# Altium schematic sheet SD-CARD.SchDoc: SD-CARD
size A3; Engineer: M.GUENI; Revision: R0; SheetNumber: 06; SheetTotal: 10
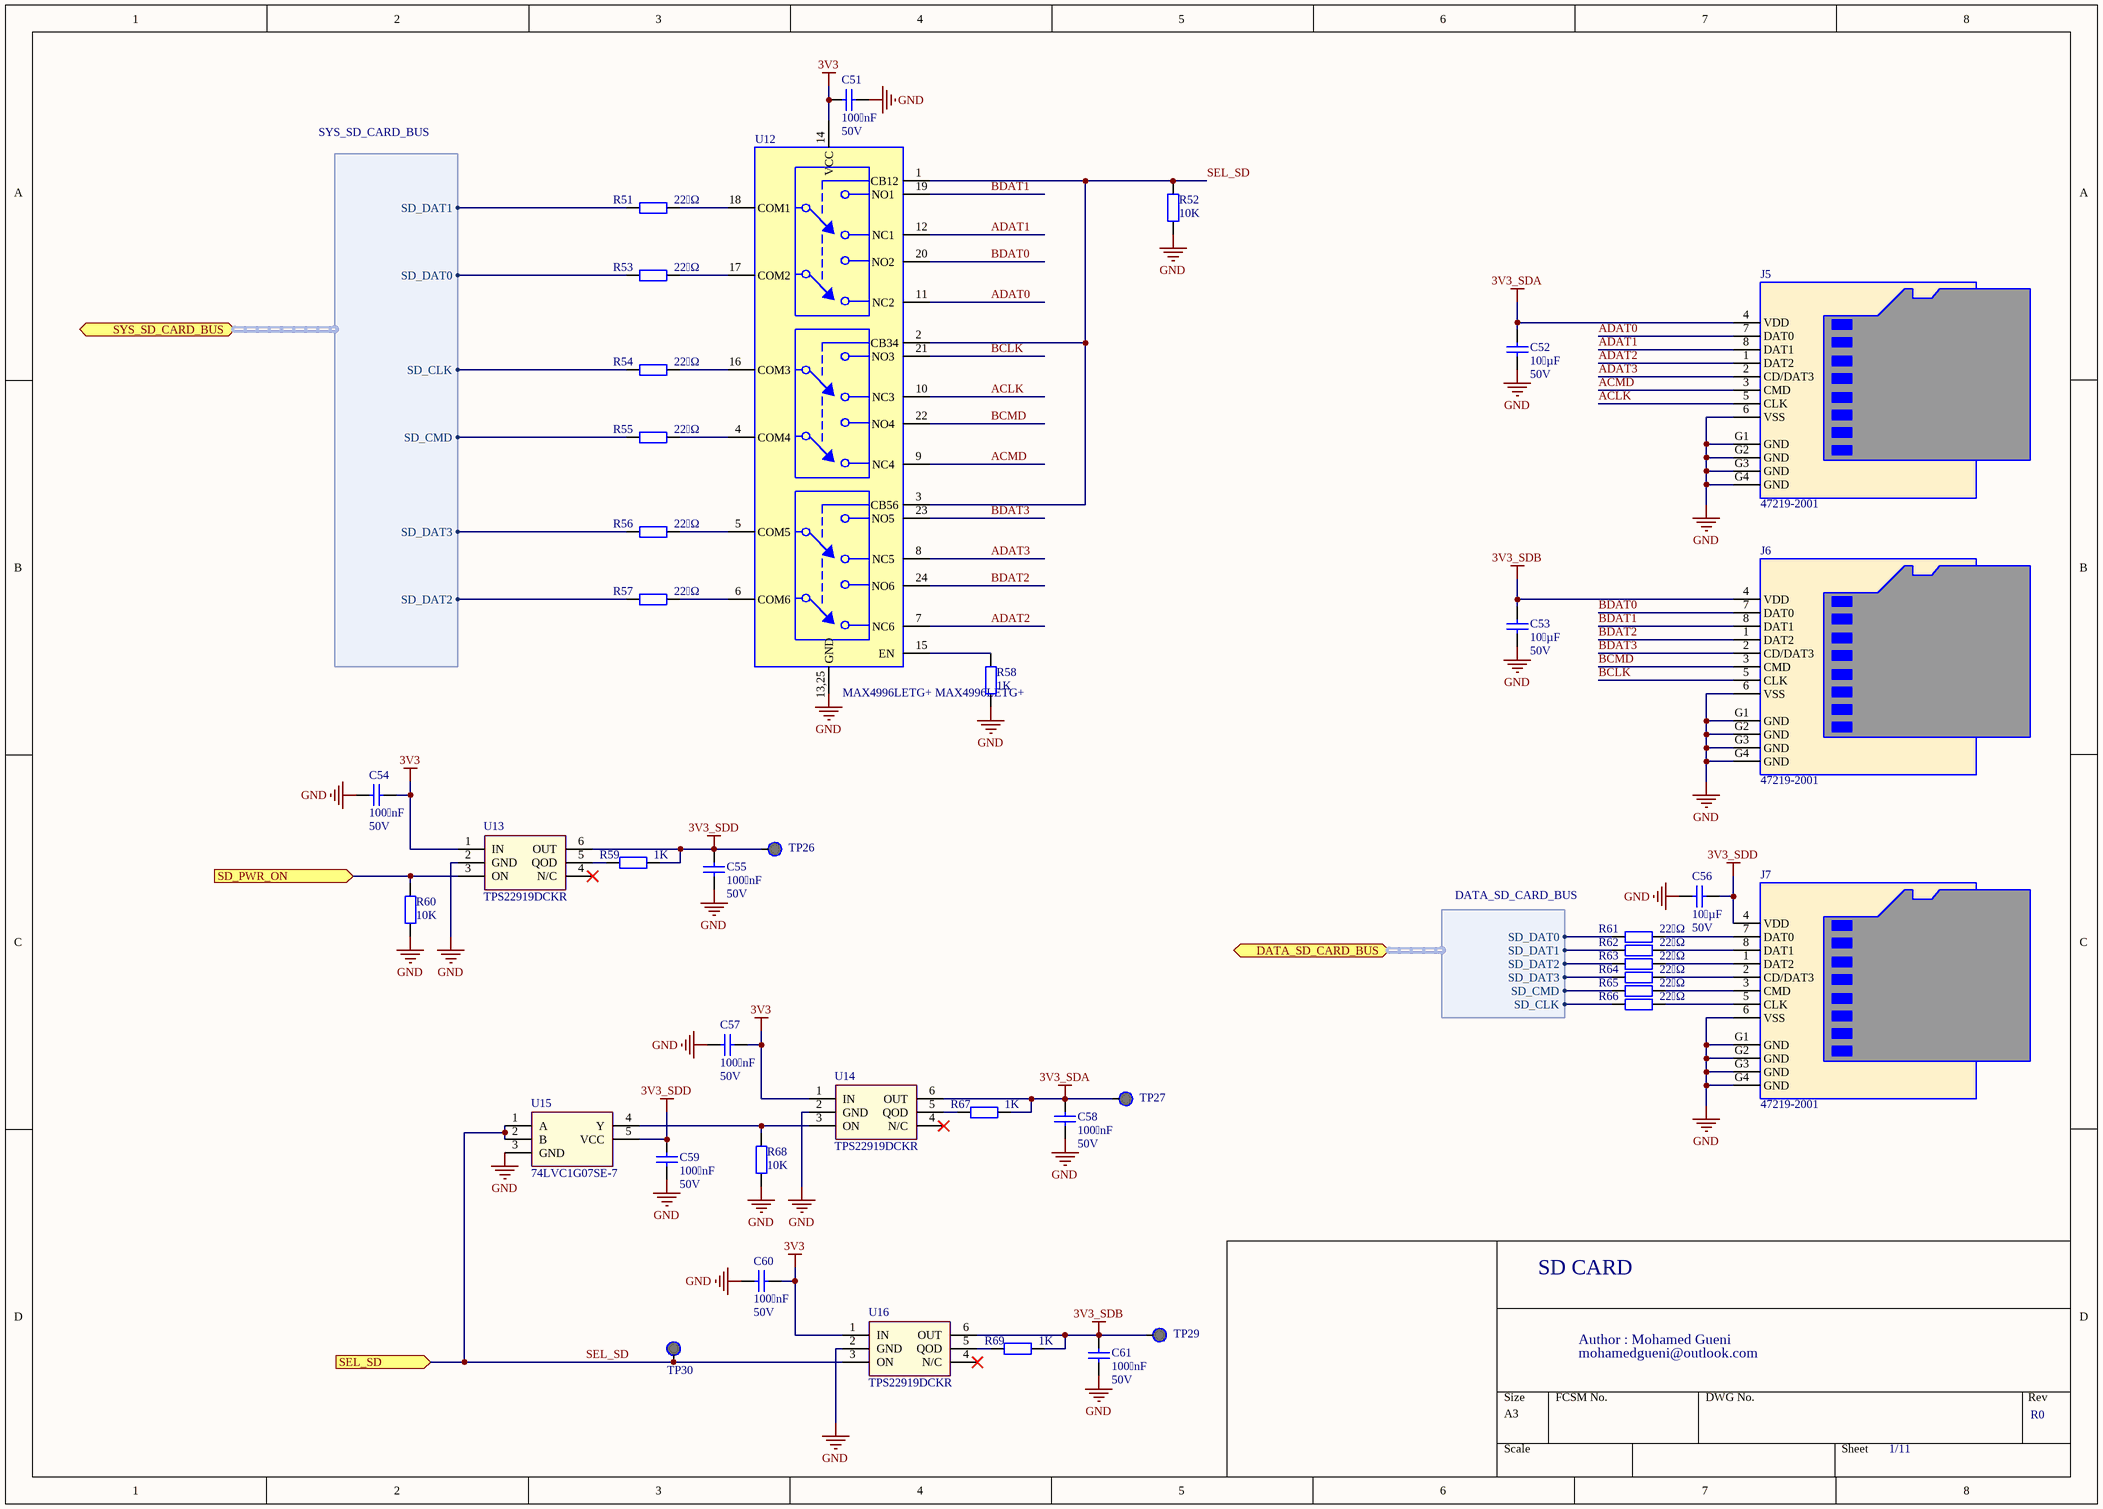
[diagram p0: SD-CARD.SchDoc]

## Parts
C51  Value 1: 100 nF  Value 2: 50V  [CAPC1608N]  (hidden comment: GRM188R71H104KA93D)
C52  Value 1: 10 µF  Value 2: 50V  [CAPC1608N]  (hidden comment: GRM188R61H106KAALD)
C53  Value 1: 10 µF  Value 2: 50V  [CAPC1608N]  (hidden comment: GRM188R61H106KAALD)
C54  Value 1: 100 nF  Value 2: 50V  [CAPC1608N]  (hidden comment: GRM188R71H104KA93D)
C55  Value 1: 100 nF  Value 2: 50V  [CAPC1608N]  (hidden comment: GRM188R71H104KA93D)
C56  Value 1: 10 µF  Value 2: 50V  [CAPC1608N]  (hidden comment: GRM188R61H106KAALD)
C57  Value 1: 100 nF  Value 2: 50V  [CAPC1608N]  (hidden comment: GRM188R71H104KA93D)
C58  Value 1: 100 nF  Value 2: 50V  [CAPC1608N]  (hidden comment: GRM188R71H104KA93D)
C59  Value 1: 100 nF  Value 2: 50V  [CAPC1608N]  (hidden comment: GRM188R71H104KA93D)
C60  Value 1: 100 nF  Value 2: 50V  [CAPC1608N]  (hidden comment: GRM188R71H104KA93D)
C61  Value 1: 100 nF  Value 2: 50V  [CAPC1608N]  (hidden comment: GRM188R71H104KA93D)
J5  47219-2001  [MOLEX-SD-47219]
J6  47219-2001  [MOLEX-SD-47219]
J7  47219-2001  [MOLEX-SD-47219]
R51  Value 1: 22 Ω  [RESC1608N]  (hidden comment: ERJ-3EKF22R0V)
R52  Value 1: 10K  [RESC1608N]  (hidden comment: RN731JTTD1002F25)
R53  Value 1: 22 Ω  [RESC1608N]  (hidden comment: ERJ-3EKF22R0V)
R54  Value 1: 22 Ω  [RESC1608N]  (hidden comment: ERJ-3EKF22R0V)
R55  Value 1: 22 Ω  [RESC1608N]  (hidden comment: ERJ-3EKF22R0V)
R56  Value 1: 22 Ω  [RESC1608N]  (hidden comment: ERJ-3EKF22R0V)
R57  Value 1: 22 Ω  [RESC1608N]  (hidden comment: ERJ-3EKF22R0V)
R58  Value 1: 1K  [RESC1608N]  (hidden comment: RN731JTTD1001F25)
R59  Value 1: 1K  [RESC1608N]  (hidden comment: RN731JTTD1001F25)
R60  Value 1: 10K  [RESC1608N]  (hidden comment: RN731JTTD1002F25)
R61  Value 1: 22 Ω  [RESC1608N]  (hidden comment: ERJ-3EKF22R0V)
R62  Value 1: 22 Ω  [RESC1608N]  (hidden comment: ERJ-3EKF22R0V)
R63  Value 1: 22 Ω  [RESC1608N]  (hidden comment: ERJ-3EKF22R0V)
R64  Value 1: 22 Ω  [RESC1608N]  (hidden comment: ERJ-3EKF22R0V)
R65  Value 1: 22 Ω  [RESC1608N]  (hidden comment: ERJ-3EKF22R0V)
R66  Value 1: 22 Ω  [RESC1608N]  (hidden comment: ERJ-3EKF22R0V)
R67  Value 1: 1K  [RESC1608N]  (hidden comment: RN731JTTD1001F25)
R68  Value 1: 10K  [RESC1608N]  (hidden comment: RN731JTTD1002F25)
R69  Value 1: 1K  [RESC1608N]  (hidden comment: RN731JTTD1001F25)
TP26  Test Point  [TP]  (value not drawn)  (no BOM)
TP27  Test Point  [TP]  (value not drawn)  (no BOM)
TP29  Test Point  [TP]  (value not drawn)  (no BOM)
TP30  Test Point  [TP]  (value not drawn)  (no BOM)
U12  MAX4996LETG+ / MAX4996LETG+  [TQFN-24]
U13  TPS22919DCKR  [SC70-TPS22919DCKR6]
U14  TPS22919DCKR  [SC70-TPS22919DCKR6]
U15  74LVC1G07SE-7  [SOT-353]
U16  TPS22919DCKR  [SC70-TPS22919DCKR6]

## Ports
DATA_SD_CARD_BUS (bidir, harness DATA_SD_CARD_BUS), SD_PWR_ON (in), SEL_SD (in), SYS_SD_CARD_BUS (bidir, harness SYS_SD_CARD_BUS)

## Harnesses
SYS_SD_CARD_BUS: SD_DAT0, SD_DAT1, SD_CMD, SD_CLK, SD_DAT2, SD_DAT3
DATA_SD_CARD_BUS: SD_DAT1, SD_DAT0, SD_DAT3, SD_DAT2, SD_CLK, SD_CMD

## Nets
3V3: C51.1 C54.1 C57.1 C60.1 U12.14(VCC) U13.1(IN) U14.1(IN) U16.1(IN)
3V3_SDA: C52.2 C58.1 J5.4(VDD) R67.1 TP27.1 U14.6(OUT)
3V3_SDB: C53.2 C61.1 J6.4(VDD) R69.1 TP29.1 U16.6(OUT)
3V3_SDD: C55.1 C56.2 C59.1 J7.4(VDD) R59.1 TP26.1 U13.6(OUT) U15.5(VCC)
GND: C51.2 C52.1 C53.1 C54.2 C55.2 C56.1 C57.2 C58.2 C59.2 C60.2 C61.2 J5.6(VSS) J5.G1(GND) J5.G2(GND) J5.G3(GND) J5.G4(GND) J6.6(VSS) J6.G1(GND) J6.G2(GND) J6.G3(GND) J6.G4(GND) J7.6(VSS) J7.G1(GND) J7.G2(GND) J7.G3(GND) J7.G4(GND) R52.1 R58.1 R60.1 R68.1 U12.13,25(GND) U13.2(GND) U14.2(GND) U15.3(GND) U16.2(GND)
ACLK: J5.5(CLK) U12.10(NC3)
ACMD: J5.3(CMD) U12.9(NC4)
ADAT0: J5.7(DAT0) U12.11(NC2)
ADAT1: J5.8(DAT1) U12.12(NC1)
ADAT2: J5.1(DAT2) U12.7(NC6)
ADAT3: J5.2(CD/DAT3) U12.8(NC5)
BCLK: J6.5(CLK) U12.21(NO3)
BCMD: J6.3(CMD) U12.22(NO4)
BDAT0: J6.7(DAT0) U12.20(NO2)
BDAT1: J6.8(DAT1) U12.19(NO1)
BDAT2: J6.1(DAT2) U12.24(NO6)
BDAT3: J6.2(CD/DAT3) U12.23(NO5)
SD_PWR_ON: R60.2 U13.3(ON) ; port SD_PWR_ON
SEL_SD: R52.2 TP30.1 U12.1(CB12) U12.2(CB34) U12.3(CB56) U15.1(A) U15.2(B) U16.3(ON) ; port SEL_SD
NetJ7_1: J7.1(DAT2) R63.2
NetJ7_2: J7.2(CD/DAT3) R64.2
NetJ7_3: J7.3(CMD) R65.2
NetJ7_5: J7.5(CLK) R66.2
NetJ7_7: J7.7(DAT0) R61.2
NetJ7_8: J7.8(DAT1) R62.2
NetR51_1: R51.1 ; port SYS_SD_CARD_BUS.SD_DAT1
NetR51_2: R51.2 U12.18(COM1)
NetR53_1: R53.1 ; port SYS_SD_CARD_BUS.SD_DAT0
NetR53_2: R53.2 U12.17(COM2)
NetR54_1: R54.1 ; port SYS_SD_CARD_BUS.SD_CLK
NetR54_2: R54.2 U12.16(COM3)
NetR55_1: R55.1 ; port SYS_SD_CARD_BUS.SD_CMD
NetR55_2: R55.2 U12.4(COM4)
NetR56_1: R56.1 ; port SYS_SD_CARD_BUS.SD_DAT3
NetR56_2: R56.2 U12.5(COM5)
NetR57_1: R57.1 ; port SYS_SD_CARD_BUS.SD_DAT2
NetR57_2: R57.2 U12.6(COM6)
NetR58_2: R58.2 U12.15(EN)
NetR59_2: R59.2 U13.5(QOD)
NetR61_1: R61.1 ; port DATA_SD_CARD_BUS.SD_DAT0
NetR62_1: R62.1 ; port DATA_SD_CARD_BUS.SD_DAT1
NetR63_1: R63.1 ; port DATA_SD_CARD_BUS.SD_DAT2
NetR64_1: R64.1 ; port DATA_SD_CARD_BUS.SD_DAT3
NetR65_1: R65.1 ; port DATA_SD_CARD_BUS.SD_CMD
NetR66_1: R66.1 ; port DATA_SD_CARD_BUS.SD_CLK
NetR67_2: R67.2 U14.5(QOD)
NetR68_2: R68.2 U14.3(ON) U15.4(Y)
NetR69_2: R69.2 U16.5(QOD)

Not connected (* = marked no-connect by the designer): U13 4(N/C)*; U14 4(N/C)*; U16 4(N/C)*

## Notes on the sheet
- SD CARD
- Author : Mohamed Gueni
- mohamedgueni@outlook.com
- 1/11
- R0
- Title:
- Micro Device Tunisie
- Size:
- Date:
- File:
- A3
- Engineer :
- Revision:
- Sheet
- of
- Cyber Parc  Hammam Sousse
- Avenue Charles De Gaulle
- 4011, Hammam-Sousse, Tunisie
- contact@mdtunisie.com

## Library data of the parts
C51 C54 C55 C57-C61 = CAP-000000017: MAN: Murata; DES: Ceramic Capacitor, 100 nF, 50V, X7R, 0603; FTP: 603; SUPREF: 81-GRM188R71H104KA93D; Part Number: CAP-000000017; MANREF: GRM188R71H104KA93D
C52 C53 C56 = CAP-000000025: MAN: Murata; DES: Ceramic Capacitor, 10 µF, 50V, X5R, 0603; FTP: 603; SUPREF: 81-GRM188R61H106KAALD; Part Number: CAP-000000025; MANREF: GRM188R61H106KAALD
J5-J7 = CON-000000001: MAN: Molex; DES: Memory Card Connectors TFR READER (HINGE TYPE); Value 1: 1.1 mm; Value 2: 500 mA; TOL: _; FTP: SMT; SUP: Mouser; SUPREF: 538-47219-2001; Part Number: CON-000000001; MANREF: 47219-2001; NOTE: _
R51 R53-R57 R61-R66 = RES-0000000019: MAN: Panasonic; DES: Thick Film Resistor, 22 Ω, 1%, 200 mW, 0603; TOL: 1%; FTP: 0603; SUP: Mouser; SUPREF: 667-ERJ-3EKF22R0V; NOTE: _; Part Number: RES-0000000019; MANREF: ERJ-3EKF22R0V
R52 R60 R68 = RES-000000007: MAN: KOA Speer; DES: Thin Film Resistors - SMD 10kOhm,0603,1%,25ppm ,63mW,50V; Value 2: 0.63W; TOL: 1%; FTP: 0603; SUP: Mouser; SUPREF: 660-RN731JTTD1002F25; NOTE: _; Part Number: RES-000000007; MANREF: RN731JTTD1002F25
R58 R59 R67 R69 = RES-000000001: MAN: KOA Speer; DES: Thin Film Resistors - SMD 1kOhm,0603,1%,25ppm, 63mW,50V; Value 2: 0.63W; TOL: 1%; FTP: 0603; SUP: Mouser; SUPREF: 660-RN731JTTD1001F25; NOTE: _; Part Number: RES-000000001; MANREF: RN731JTTD1001F25
TP26 TP27 TP29 TP30 = MIS-000000002: MAN: _; Part Number: MIS-000000002; MANREF: _; DES: _; Value 1: _; Value 2: _; TOL: _; FTP: _; SUP: _; SUPREF: _; NOTE: _
U12 = GIC-000000001: MAN: Maxim Integrated; DES: Analogue Switch ICs Triple DPDT, Low-Capacitance Data Switches; Value 1: 5.5 V; Value 2: 10 uA; TOL: _; SUP: Mouser; SUPREF: 700-MAX4996LETG; Part Number: GIC-000000001; MANREF: MAX4996LETG+ / MAX4996LETG+; FTP: TQFN-24; NOTE: _
U13 U14 U16 = ICP-000000002: MAN: Texas Instruments; DES: Power Switch ICs - Power Distribution 5.5-V 1.5-A 90-moh m load switch with a A 595-TPS22919DCKT; Value 1: 1.5 A; Value 2: 1.6 V to 5.5 V; TOL: _; FTP: SC70-6; SUP: Mouser; SUPREF: 595-TPS22919DCKR; Part Number: ICP-000000002; MANREF: TPS22919DCKR; NOTE: -
U15 = GIC-000000008: MAN: Diodes Incorporated; DES: Buffers & Line Drivers Single Gate Open Out 1.65 to 5.5V 32mA; Value 1: 5.5 V; Value 2: 32 mA; TOL: _; SUP: Mouser; SUPREF: 621-74LVC1G07SE-7; Part Number: GIC-000000008; MANREF: 74LVC1G07SE-7; FTP: SOT-353; NOTE: _